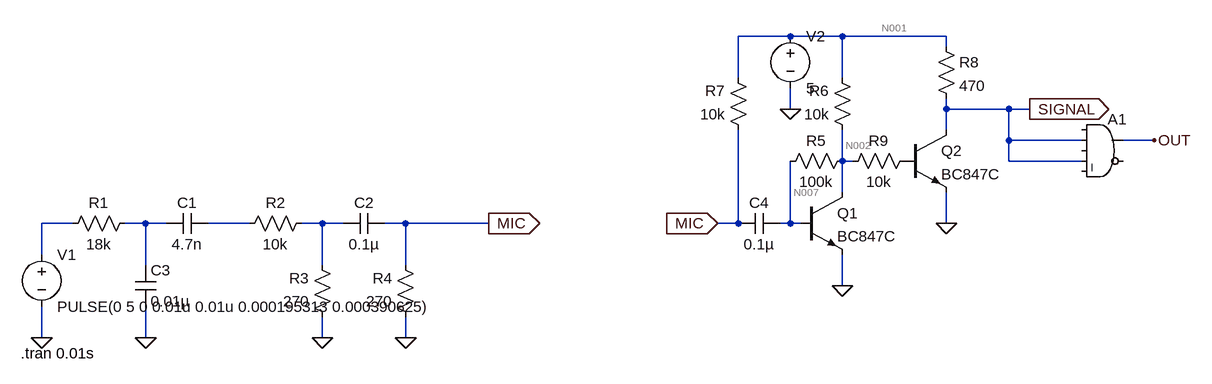
[diagram p0: schematic cmt-out-2.asc]
cmt-out-2.asc, the LTspice schematic file:
Version 4
SHEET 1 1840 680
WIRE 1152 -400 1072 -400
WIRE 1232 -400 1152 -400
WIRE 1392 -400 1232 -400
WIRE 1392 -384 1392 -400
WIRE 1072 -336 1072 -400
WIRE 1232 -336 1232 -400
WIRE 1152 -288 1152 -320
WIRE 1392 -288 1392 -304
WIRE 1488 -288 1392 -288
WIRE 1520 -288 1488 -288
WIRE 1392 -256 1392 -288
WIRE 1488 -240 1488 -288
WIRE 1600 -240 1488 -240
WIRE 1712 -240 1664 -240
WIRE 1232 -208 1232 -256
WIRE 1248 -208 1232 -208
WIRE 1488 -208 1488 -240
WIRE 1600 -208 1488 -208
WIRE 1232 -160 1232 -208
WIRE 48 -112 0 -112
WIRE 160 -112 128 -112
WIRE 192 -112 160 -112
WIRE 320 -112 256 -112
WIRE 432 -112 400 -112
WIRE 464 -112 432 -112
WIRE 560 -112 528 -112
WIRE 688 -112 560 -112
WIRE 1072 -112 1072 -256
WIRE 1072 -112 1040 -112
WIRE 1152 -112 1152 -208
WIRE 1152 -112 1136 -112
WIRE 1168 -112 1152 -112
WIRE 1392 -112 1392 -160
WIRE 0 -64 0 -112
WIRE 160 -48 160 -112
WIRE 432 -48 432 -112
WIRE 560 -48 560 -112
WIRE 1232 -16 1232 -64
WIRE 0 64 0 16
WIRE 160 64 160 16
WIRE 432 64 432 32
WIRE 560 64 560 32
FLAG 0 64 0
FLAG 432 64 0
FLAG 560 64 0
FLAG 160 64 0
FLAG 688 -112 MIC
IOPIN 688 -112 Out
FLAG 1040 -112 MIC
IOPIN 1040 -112 In
FLAG 1232 -16 0
FLAG 1152 -288 0
FLAG 1392 -112 0
FLAG 1520 -288 SIGNAL
IOPIN 1520 -288 Out
FLAG 1712 -240 OUT
SYMBOL voltage 0 -80 R0
WINDOW 123 0 0 Left 2
WINDOW 39 0 0 Left 2
SYMATTR InstName V1
SYMATTR Value PULSE(0 5 0 0.01u 0.01u 0.000195313 0.000390625)
SYMBOL res 144 -128 R90
WINDOW 0 0 56 VBottom 2
WINDOW 3 32 56 VTop 2
SYMATTR InstName R1
SYMATTR Value 18k
SYMBOL res 416 -128 R90
WINDOW 0 0 56 VBottom 2
WINDOW 3 32 56 VTop 2
SYMATTR InstName R2
SYMATTR Value 10k
SYMBOL res 448 48 R180
WINDOW 0 36 76 Left 2
WINDOW 3 36 40 Left 2
SYMATTR InstName R3
SYMATTR Value 270
SYMBOL res 576 48 R180
WINDOW 0 36 76 Left 2
WINDOW 3 36 40 Left 2
SYMATTR InstName R4
SYMATTR Value 270
SYMBOL cap 256 -128 R90
WINDOW 0 0 32 VBottom 2
WINDOW 3 32 32 VTop 2
SYMATTR InstName C1
SYMATTR Value 4.7n
SYMBOL cap 528 -128 R90
WINDOW 0 0 32 VBottom 2
WINDOW 3 32 32 VTop 2
SYMATTR InstName C2
SYMATTR Value 0.1µ
SYMBOL cap 144 -48 R0
SYMATTR InstName C3
SYMATTR Value 0.01µ
SYMBOL cap 1136 -128 R90
WINDOW 0 0 32 VBottom 2
WINDOW 3 32 32 VTop 2
SYMATTR InstName C4
SYMATTR Value 0.1µ
SYMBOL res 1248 -224 R90
WINDOW 0 0 56 VBottom 2
WINDOW 3 32 56 VTop 2
SYMATTR InstName R5
SYMATTR Value 100k
SYMBOL res 1248 -240 R180
WINDOW 0 36 76 Left 2
WINDOW 3 36 40 Left 2
SYMATTR InstName R6
SYMATTR Value 10k
SYMBOL res 1088 -240 R180
WINDOW 0 36 76 Left 2
WINDOW 3 36 40 Left 2
SYMATTR InstName R7
SYMATTR Value 10k
SYMBOL npn 1168 -160 R0
SYMATTR InstName Q1
SYMATTR Value BC847C
SYMBOL voltage 1152 -416 R0
WINDOW 123 0 0 Left 2
WINDOW 39 0 0 Left 2
SYMATTR InstName V2
SYMATTR Value 5
SYMBOL npn 1328 -256 R0
SYMATTR InstName Q2
SYMATTR Value BC847C
SYMBOL res 1376 -400 R0
SYMATTR InstName R8
SYMATTR Value 470
SYMBOL res 1344 -224 R90
WINDOW 0 0 56 VBottom 2
WINDOW 3 32 56 VTop 2
SYMATTR InstName R9
SYMATTR Value 10k
SYMBOL Digital\\and 1632 -288 R0
SYMATTR InstName A1
TEXT -32 88 Left 2 !.tran 0.01s

The netlist it stands for:
* cmt-out-2.asc
V1 N003 0 PULSE(0 5 0 0.01u 0.01u 0.000195313 0.000390625)
R1 N004 N003 18k
R2 N006 N005 10k
R3 0 N006 270
R4 0 MIC 270
C1 N005 N004 4.7n
C2 MIC N006 0.1µ
C3 N004 0 0.01µ
C4 N007 MIC 0.1µ
R5 N002 N007 100k
R6 N002 N001 10k
R7 MIC N001 10k
Q1 N002 N007 0 0 BC847C
V2 N001 0 5
Q2 SIGNAL P001 0 0 BC847C
R8 N001 SIGNAL 470
R9 P001 N002 10k
A1 0 SIGNAL 0 SIGNAL 0 0 OUT 0 AND
.model NPN NPN
.model PNP PNP
.lib standard.bjt
.tran 0.01s
.backanno
.end

* Results of the author's LTspice run, read from the files saved beside the schematic
* Operating Point, zero values left out:
*   V(mic) = 131.5 mV
*   V(n007) = 607.4 mV
*   V(n002) = 695.4 mV
*   V(n001) = 5 V
*   V(signal) = 3.927 V
*   V(p001) = 650.7 mV
*   V(out) = 1 V
*   Ic(Q2) = 2.283 mA
*   Ib(Q2) = 4.471 µA
*   Ie(Q2) = -2.287 mA
*   Ic(Q1) = 425.1 µA
*   Ib(Q1) = 880.2 nA
*   Ie(Q1) = -426 µA
*   I(R9) = -4.472 µA
*   I(R8) = 2.283 mA
*   I(R7) = -486.9 µA
*   I(R6) = -430.5 µA
*   I(R5) = 880.2 nA
*   I(R4) = -486.9 µA
*   I(V2) = -3.2 mA
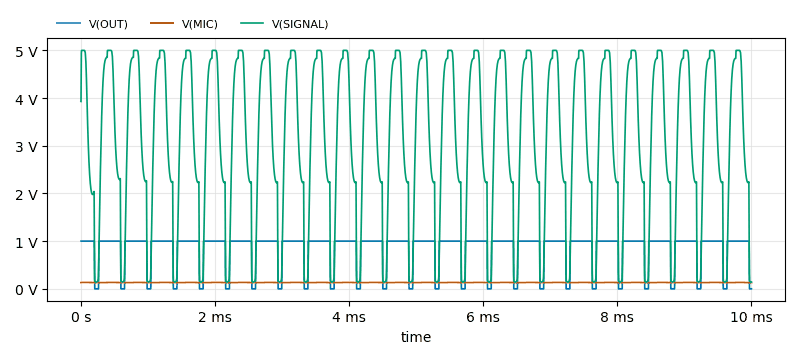
[diagram p1: Transient Analysis of cmt-out-2.asc, plotted from the saved traces]
* Transient Analysis, 1 run:
*   V(OUT): min 0 V, max 1 V, average 844.7 mV, rms 917.3 mV, last 0 V
*   V(MIC): min 126.6 mV, max 135.7 mV, average 131.5 mV, rms 131.5 mV, last 126.9 mV
*   V(SIGNAL): min 139.5 mV, max 5 V, average 3.152 V, rms 3.591 V, last 142.7 mV